# EAGLE design untitled (EAGLE 8.7.1)
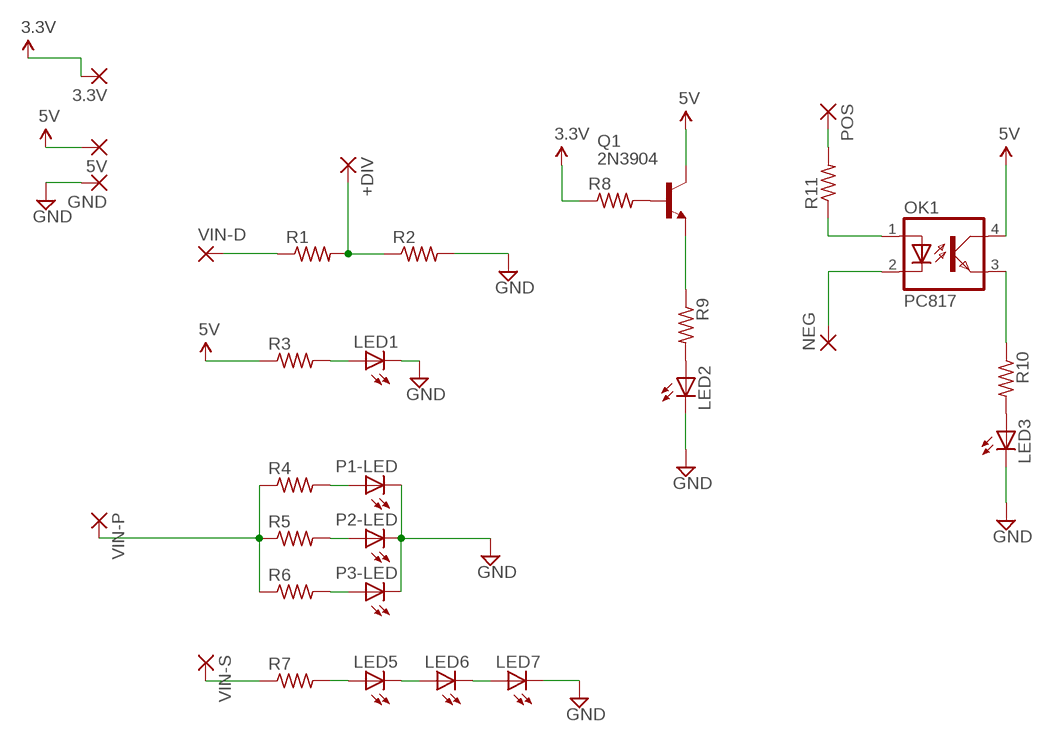
[diagram p0: schematic, sheet 1]

## Parts
3.3V  2,54/1,0  [2,54/1,0]
5V  2,54/1,0  [2,54/1,0]
+DIV  2,54/1,0  [2,54/1,0]
GND  2,54/1,0  [2,54/1,0]
LED1  LEDCHIPLED_0805  [CHIPLED_0805]
LED2  LEDCHIPLED_0805  [CHIPLED_0805]
LED3  LEDCHIPLED_0805  [CHIPLED_0805]
LED5  LEDCHIPLED_0805  [CHIPLED_0805]
LED6  LEDCHIPLED_0805  [CHIPLED_0805]
LED7  LEDCHIPLED_0805  [CHIPLED_0805]
NEG  2,54/1,0  [2,54/1,0]
OK1  PC817  [DIL04]
P1-LED  LEDCHIPLED_0805  [CHIPLED_0805]
P2-LED  LEDCHIPLED_0805  [CHIPLED_0805]
P3-LED  LEDCHIPLED_0805  [CHIPLED_0805]
POS  2,54/1,0  [2,54/1,0]
Q1  2N3904  [TO92]
R1  R-US_R0805  [R0805]
R2  R-US_R0805  [R0805]
R3  R-US_R0805  [R0805]
R4  R-US_R0805  [R0805]
R5  R-US_R0805  [R0805]
R6  R-US_R0805  [R0805]
R7  R-US_R0805  [R0805]
R8  R-US_R0805  [R0805]
R9  R-US_R0805  [R0805]
R10  R-US_R0805  [R0805]
R11  R-US_R0805  [R0805]
VIN-D  2,54/1,0  [2,54/1,0]
VIN-P  2,54/1,0  [2,54/1,0]
VIN-S  2,54/1,0  [2,54/1,0]

## Nets
3.3V: 3.3V.1(P) R8.1
5V: 5V.1(P) OK1.4(COL) Q1.1(C) R3.1
GND: GND.1(P) LED1.C LED2.C LED3.C LED7.C P1-LED.C P2-LED.C P3-LED.C R2.2
N$1: +DIV.1(P) R1.2 R2.1
N$2: R1.1 VIN-D.1(P)
N$3: LED1.A R3.2
N$4: P1-LED.A R4.2
N$5: P2-LED.A R5.2
N$6: P3-LED.A R6.2
N$7: Q1.2(B) R8.2
N$8: LED5.C LED6.A
N$9: LED6.C LED7.A
N$10: LED5.A R7.2
N$11: R7.1 VIN-S.1(P)
N$12: R4.1 R5.1 R6.1 VIN-P.1(P)
N$13: LED2.A R9.2
N$14: Q1.3(E) R9.1
N$15: LED3.A R10.2
N$16: OK1.3(EMIT) R10.1
N$17: OK1.1(A) R11.1
N$18: POS.1(P) R11.2
N$19: NEG.1(P) OK1.2(C)

## Library data of the parts
3.3V 5V +DIV GND NEG POS VIN-D VIN-P VIN-S = wirepad:2,54/1,0: THROUGH-HOLE PAD
LED1-LED3 LED5-LED7 P1-LED P2-LED P3-LED = led:LED: LED OSRAM: - CHIPLED LG R971, LG N971, LY N971, LG Q971, LY Q971, LO R971, LY R971 LH N974, LH R974 LS Q976, LO Q976, LY Q976 LO Q996 - Hyper CHIPLED LW Q18S LB Q993, LB Q99A, LB R99A - SideLED LS A670, LO A670, LY A670, LG A670, LP A670 LB A673, LV A673, LT A673, LW A673 LH A674 LY A675 LS A676, LA A676, LO A676, LY A676, LW A676 LS A679, LY A679, LG A679 - Hyper Micro SIDELED® LS Y876, LA Y876, LO Y876, LY Y876 LT Y87S - SmartLED LW L88C, LW L88S LB L89C, LB L89S, LG L890 LS L89K, LO L89K, LY L89K LS L896, LA L896, LO L896, LY L896 - TOPLED LS T670, LO T670, LY T670, LG T670, LP T670 LSG T670, LSP T670, LSY T670, LOP T670, LYG T670 LG T671, LOG T671, LSG T671 LB T673, LV T673, LT T673, LW T673 LH T674 LS T676, LA T676, LO T676, LY T676, LB T676, LH T676, LSB T676, LW T676 LB T67C, LV T67C, LT T67C, LS T67K, LO T67K, LY T67K, LW E67C LS E67B, LA E67B, LO E67B, LY E67B, LB E67C, LV E67C, LT E67C LW T67C LS T679, LY T679, LG T679 LS T770, LO T770, LY T770, LG T770, LP T770 LB T773, LV T773, LT T773, LW T773 LH T774 LS E675, LA E675, LY E675, LS T675 LS T776, LA T776, LO T776, LY T776, LB T776 LHGB T686 LT T68C, LB T68C - Hyper Mini TOPLED® LB M676 - Mini TOPLED Santana® LG M470 LS M47K, LO M47K, LY M47K Source: http://www.osram.convergy.de LUXEON: - LUMILED® LXK2-PW12-R00, LXK2-PW12-S00, LXK2-PW14-U00, LXK2-PW14-V00 LXK2-PM12-R00, LXK2-PM12-S00, LXK2-PM14-U00 LXK2-PE12-Q00, LXK2-PE12-R00, LXK2-PE12-S00, LXK2-PE14-T00, LXK2-PE14-U00 LXK2-PB12-K00, LXK2-PB12-L00, LXK2-PB12-M00, LXK2-PB14-N00, LXK2-PB14-P00, LXK2-PB14-Q00 LXK2-PR12-L00, LXK2-PR12-M00, LXK2-PR14-Q00, LXK2-PR14-R00 LXK2-PD12-Q00, LXK2-PD12-R00, LXK2-PD12-S00 LXK2-PH12-R00, LXK2-PH12-S00 LXK2-PL12-P00, LXK2-PL12-Q00, LXK2-PL12-R00 Source: www.luxeon.com KINGBRIGHT: KA-3528ASYC Source: www.kingbright.com
OK1 = optocoupler:PC817: SHARP OPTO COUPLER; MPN: PC817X4J000F; OC_FARNELL: 9707727; OC_NEWARK: 97K7059
Q1 = transistor-npn:2N3904: NPN Transistor
R1-R11 = resistor:R-US_: RESISTOR, American symbol

## Net classes
0 default: width 0.254 mm, drill 0.254 mm, clearance 0.254 mm

## Board
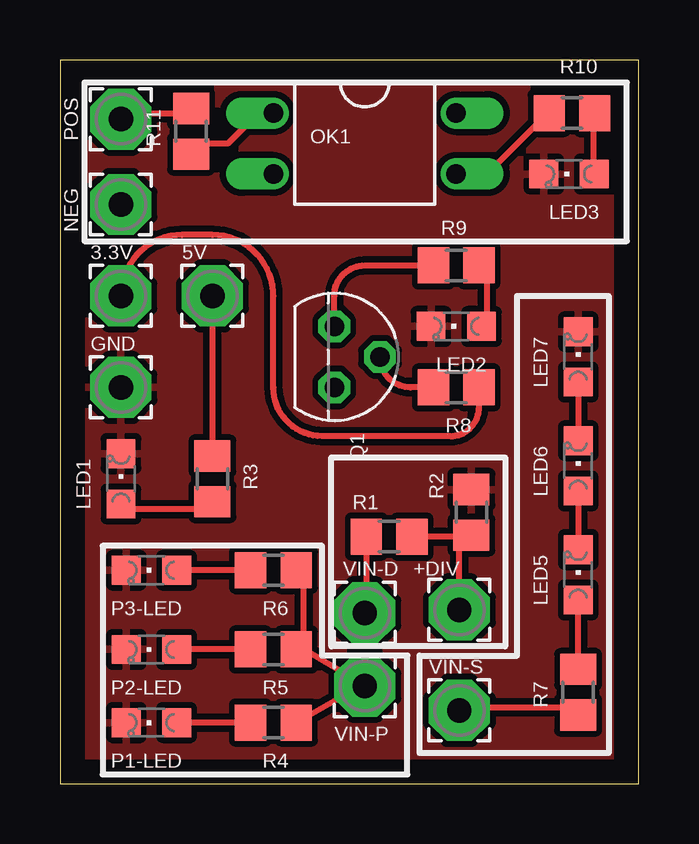
[diagram p1: board, top side]
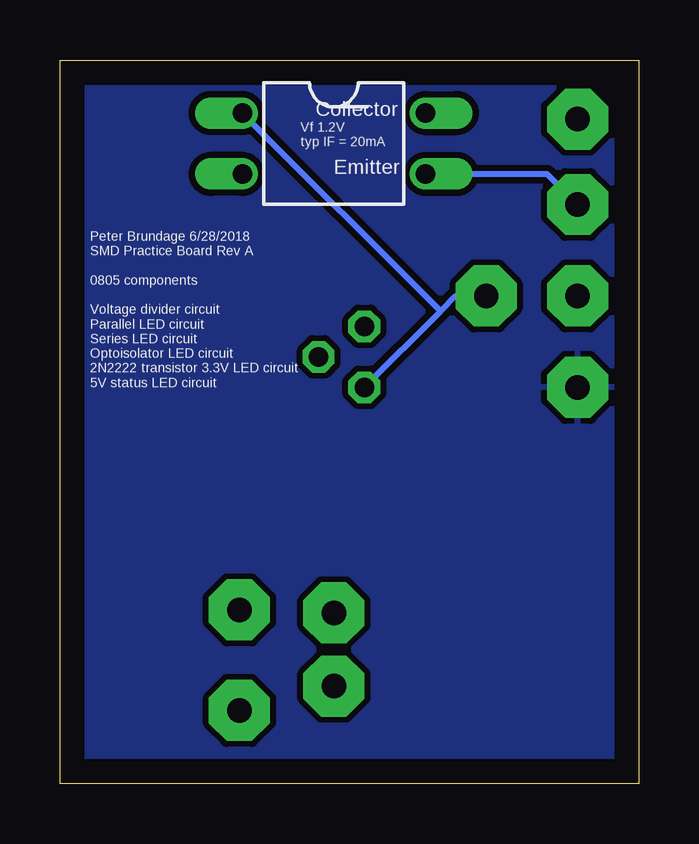
[diagram p2: board, bottom side, seen from below]

Size 24.11 x 30.15 mm. Coordinates in mm from the lower left corner, seen from the top.
Outline: 0,0 24.11,0 24.11,30.15 0,30.15 0,0
Copper layers (1*16): Top 0.035mm / dielectric 1.5mm / Bottom 0.035mm
Design rules "default": minimum track width 6mil, minimum drill 0.35mm, track to track 6mil, track to pad 6mil, pad to pad 6mil, via to via 6mil, smd to smd 6mil, copper to edge 40mil, drill to drill 6mil, minimum pad ring 10mil, minimum via ring 8mil, stop-mask expansion 4mil, vias tented up to drill 0mil, thermal gap 10mil

### Footprints (pad centres in the part's own frame; a part is rotated, then mirrored left to right if it is on the bottom)
2,54/1,0 = drill 1.016 pad 2.54 octagon: 1 0,0
CHIPLED_0805 = smd 1.2 x 1.2: A 0,-1.05; C 0,1.05
DIL04 = drill 0.813 offset: 1 -1.27,-3.81; 2 1.27,-3.81; 3 1.27,3.81; 4 -1.27,3.81
TO92 = drill 0.813 octagon: 1 1.27,0; 2 0,1.905; 3 -1.27,0
R0805 = smd 1.3 x 1.5: 1 -0.95,0; 2 0.95,0

### Placement (x,y rotation side)
3.3V  2.54,20.32 0 top
5V  6.35,20.32 0 top
+DIV  16.64,7.24 180 top
GND  2.54,16.51 0 top
LED1  2.54,12.7 0 top
LED2  16.51,19.05 90 top
LED3  21.21,25.4 90 top
LED5  21.59,8.7 0 top
LED6  21.59,13.24 0 top
LED7  21.59,17.78 0 top
NEG  2.54,24.13 0 top
OK1  12.7,26.67 270 top
P1-LED  3.81,2.54 90 top
P2-LED  3.81,5.59 90 top
P3-LED  3.81,8.89 90 top
POS  2.54,27.69 0 top
Q1  11.43,17.78 270 top
R1  13.72,10.29 0 top
R2  17.14,11.3 90 top
R3  6.35,12.7 270 top
R4  8.89,2.54 180 top
R5  8.89,5.59 180 top
R6  8.89,8.89 180 top
R7  21.59,3.81 90 top
R8  16.51,16.51 180 top
R9  16.51,21.59 0 top
R10  21.34,27.94 0 top
R11  5.46,27.18 90 top
VIN-D  12.7,7.11 180 top
VIN-P  12.7,4.06 0 top
VIN-S  16.64,3.05 0 top

### Tracks (layer width: path | path; a pad name or v marks a point on that pad's centre or on a via)
3.3V
  Top 0.254: 17.14,16.51 R8.1 17.46,15.68 arc-90 16.26,14.48 10.92,14.48 arc-90 8.89,16.51 8.89,20.32 arc90 6.35,22.86 5.08,22.86 arc90 3.3V.1
5V
  Top 0.254: 5V.1 R3.1
  Bottom 0.254: 8.26,19.68 7.62,20.32 5V.1 | 8.26,19.68 Q1.1 | 8.26,19.68 OK1.4
GND
  pour Top: -13.97,33.02 33.02,39.37 41.91,25.4 34.29,-2.54 34.29,-5.08 -3.81,-6.35 -13.97,-1.27
  pour Bottom: -2.54,33.02 27.94,33.02 27.94,-3.81 -2.54,-3.81
N$1
  Top 0.254: +DIV.1 16.64,10.35 R2.1 17.14,10.29 R1.2
N$2
  Top 0.254: R1.1 12.77,7.11 VIN-D.1
N$3
  Top 0.254: LED1.A 2.54,11.43 6.35,11.43 R3.2
N$4
  Top 0.254: R4.2 P1-LED.A
N$5
  Top 0.254: R5.2 P2-LED.A
N$6
  Top 0.254: R6.2 P3-LED.A
N$7
  Top 0.254: R8.2 14.61,16.51 arc-90 Q1.2
N$8
  Top 0.254: LED6.A LED5.C
N$9
  Top 0.254: LED7.A LED6.C
N$10
  Top 0.254: R7.2 LED5.A
N$11
  Top 0.254: R7.1 21.59,3.17 17.14,3.17 VIN-S.1
N$12
  Top 0.254: 12.06,3.81 12.7,3.81 VIN-P.1 12.06,3.81 | 12.06,3.81 R4.1 | 10.16,5.59 12.06,4.45 12.06,3.81 | 10.16,5.59 10.16,8.89 R6.1 | 10.16,5.59 R5.1
N$13
  Top 0.254: LED2.A 17.78,19.05 17.78,21.59 R9.2
N$14
  Top 0.254: Q1.3 11.43,20.32 arc-90 12.7,21.59 R9.1
N$15
  Top 0.254: LED3.A 22.23,25.4 22.23,27.94 R10.2
N$16
  Top 0.254: OK1.3 17.78,25.4 20.32,27.94 R10.1
N$17
  Top 0.254: OK1.1 8.26,27.94 6.99,26.67 5.71,26.67 R11.1
N$18
  Top 0.254: R11.2 5.08,27.94 2.54,27.94 POS.1
N$19
  Bottom 0.254: OK1.2 3.81,25.4 NEG.1

### Text on the board
bPlace: Collector | Vf 1.2V / typ IF = 20mA | Emitter | Peter Brundage 6/28/2018 / SMD Practice Board Rev A / / 0805 components / / Voltage divider circuit / Parallel LED circuit / Series LED circuit / Optoisolator LED circuit / 2N2222 transistor 3.3V LED circuit / 5V status LED circuit